# Altium schematic sheet AT Guard Simple Main.SchDoc
size C
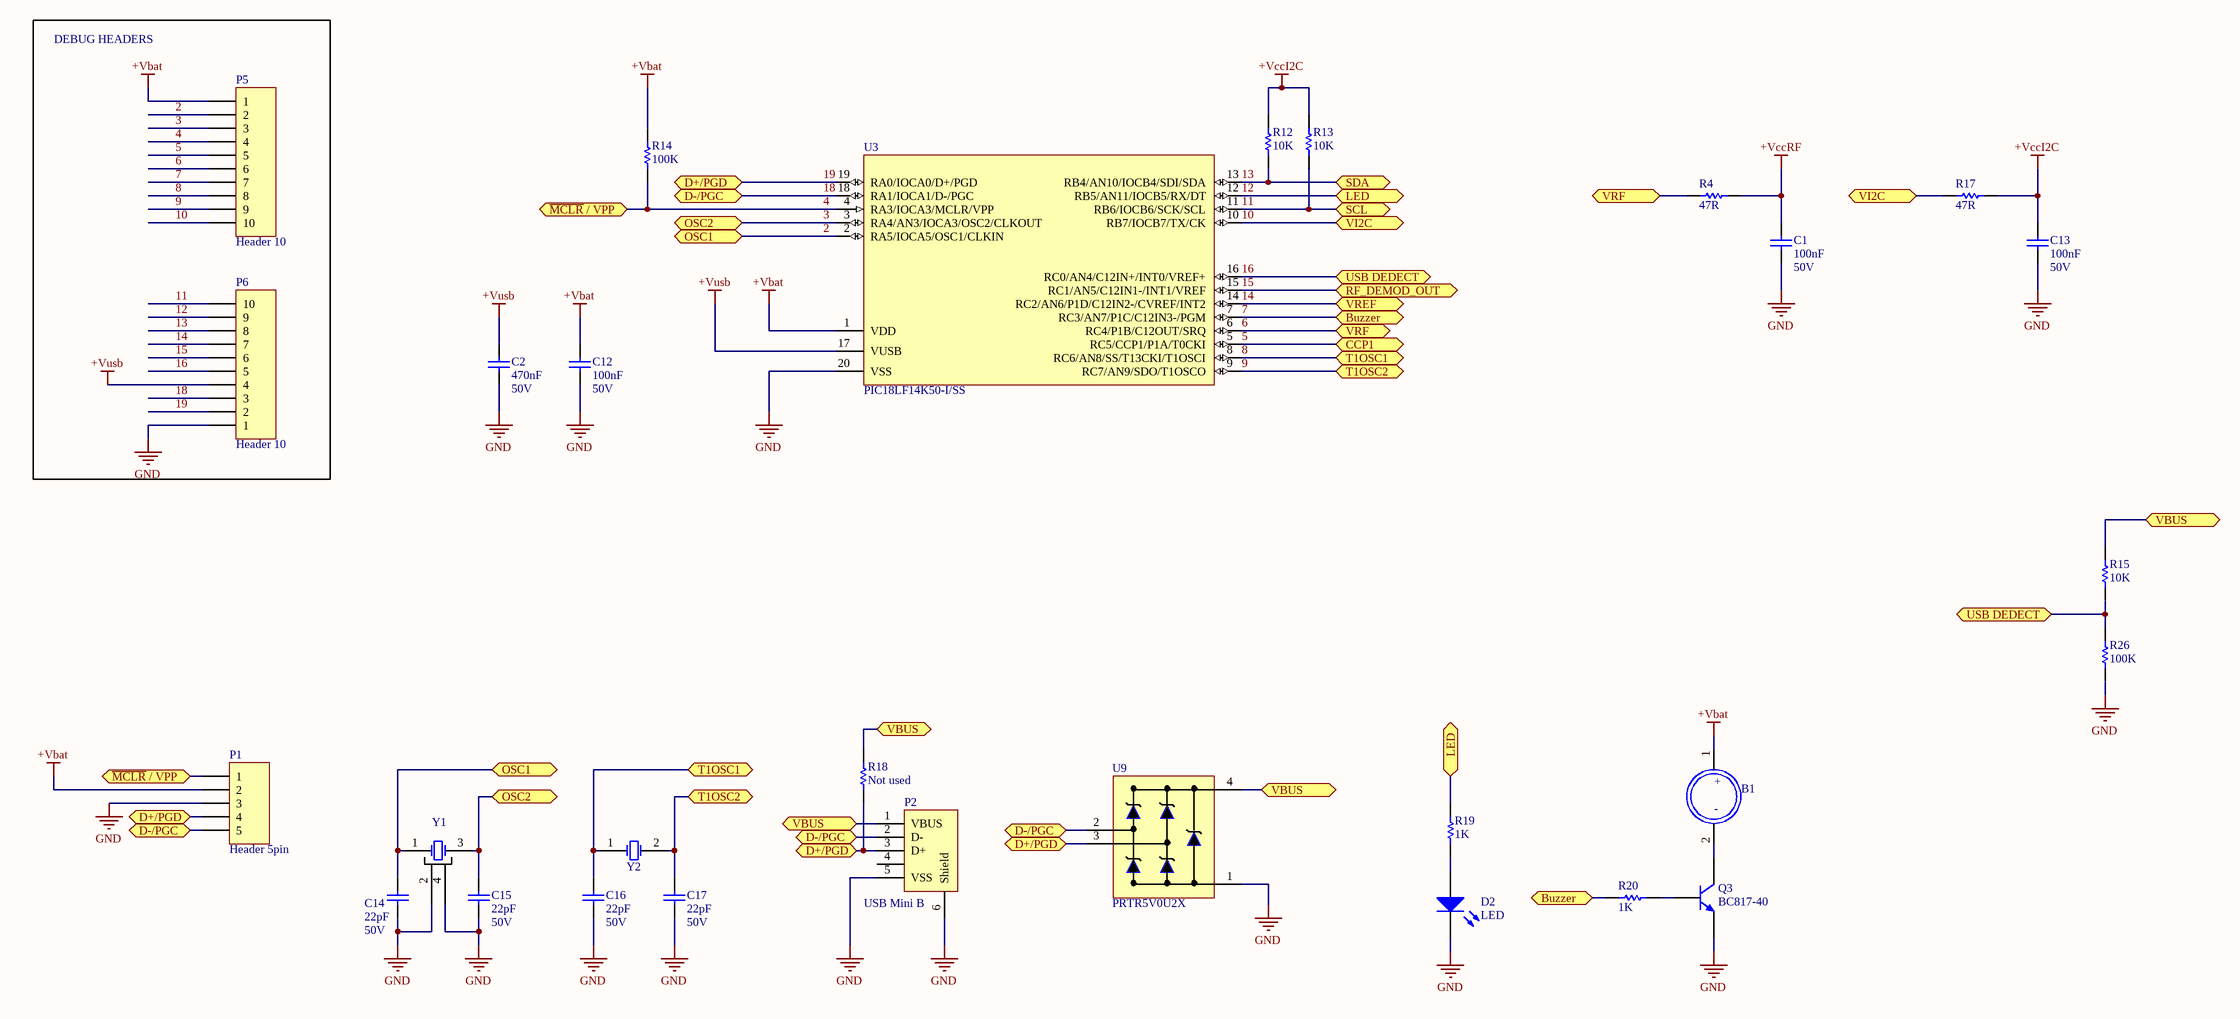
[diagram p0: AT Guard Simple Main.SchDoc]

## Parts
B1  Buzzer 5V r=12mm, h=7.5 mm  [Buzzer 9x5.5 mm]  (value not drawn)
C1  value 100nF  Voltage: 50V  [3-0603_N]  (hidden comment: Cap)
C2  value 470nF  Voltage: 50V  [3-0603_L]  (hidden comment: Cap)
C12  value 100nF  Voltage: 50V  [3-0603_L]  (hidden comment: Cap)
C13  value 100nF  Voltage: 50V  [3-0603_L]  (hidden comment: Cap)
C14  value 22pF  Voltage: 50V  [3-0603_L]  (hidden comment: Cap)
C15  value 22pF  Voltage: 50V  [3-0603_L]  (hidden comment: Cap)
C16  value 22pF  Voltage: 50V  [3-0603_L]  (hidden comment: Cap)
C17  value 22pF  Voltage: 50V  [3-0603_L]  (hidden comment: Cap)
D2  LED  [6-0805 - LED]
P1  Header 5pin  [Header 1.27mm 5P]
P2  USB Mini B  [USB Mini B Female_N 2]
P5  Header 10  [Header 1.27mm 10P]
P6  Header 10  [Header 1.27mm 10P]
Q3  BC817-40  [SOT23_N]
R4  value 47R  [3-0603_N]  (hidden comment: Res1)
R12  value 10K  [3-0603_L]  (hidden comment: Res1)
R13  value 10K  [3-0603_L]  (hidden comment: Res1)
R14  value 100K  [3-0603_L]  (hidden comment: Res1)
R15  value 10K  [3-0603_L]  (hidden comment: Res1)
R17  value 47R  [3-0603_L]  (hidden comment: Res1)
R18  value Not used  [3-0603_L]  (hidden comment: Res1)
R19  value 1K  [3-0603_L]  (hidden comment: Res1)
R20  value 1K  [3-0603_L]  (hidden comment: Res1)
R26  value 100K  [3-0603_L]  (hidden comment: Res1)
U3  PIC18LF14K50-I/SS  [SSOP-20]
U9  PRTR5V0U2X  [SOT-143B]
Y1  Crystal Oscillator  [4x2.5mm & 3.2x2.5 mm SMD CRYSTAL - duplicate]  (value not drawn)
Y2  XTAL_SMT  [32768 SMT 2.1x6.2mm Crystal]  (value not drawn)

## Blocks framed on the sheet
DEBUG HEADERS: P5 P6

## Ports
Buzzer (bidir), CCP1 (bidir), D+/PGD (bidir), D-/PGC (bidir), LED (bidir), OSC1 (bidir), OSC2 (bidir), RF_DEMOD_OUT (bidir), SCL (bidir), SDA (bidir), T1OSC1 (bidir), T1OSC2 (bidir), USB DEDECT (bidir), VBUS, VI2C (bidir), VREF (bidir), VRF (bidir), ~{MCLR} / VPP (bidir)

## Nets
+Vbat: B1.1 C12.2 P1.2 P5.1 R14.2 U3.1(VDD)
+VccI2C: C13.2 R12.2 R13.2 R17.2
+VccRF: C1.2 R4.2
+Vusb: C2.2 P6.4 U3.17(VUSB)
GND: C1.1 C2.1 C12.1 C13.1 C14.1 C15.1 C16.1 C17.1 D2.2(K) P1.3 P2.5(VSS) P2.6(Shield) P6.1 Q3.2(E) R26.1 U3.20(VSS) U9.1 Y1.2(GND) Y1.4(GND)
2: C14.2 P5.2 U3.2(RA5/IOCA5/OSC1/CLKIN) Y1.1(OSC1) ; port OSC1
3: C15.2 P5.3 U3.3(RA4/AN3/IOCA3/OSC2/CLKOUT) Y1.3(OSC2) ; port OSC2
4: P1.1 P5.4 R14.1 U3.4(RA3/IOCA3/MCLR/VPP) ; port ~{MCLR} / VPP
5: P5.5 U3.5(RC5/CCP1/P1A/T0CKI) ; port CCP1
6: P5.6 R4.1 U3.6(RC4/P1B/C12OUT/SRQ) ; port VRF
7: P5.7 R20.2 U3.7(RC3/AN7/P1C/C12IN3-/PGM) ; port Buzzer
8: C16.2 P5.8 U3.8(RC6/AN8/SS/T13CKI/T1OSCI) Y2.1(OSC1) ; port T1OSC1
9: C17.2 P5.9 U3.9(RC7/AN9/SDO/T1OSCO) Y2.2(OSC2) ; port T1OSC2
10: P5.10 R17.1 U3.10(RB7/IOCB7/TX/CK) ; port VI2C
11: P6.10 R13.1 U3.11(RB6/IOCB6/SCK/SCL) ; port SCL
12: P6.9 R19.2 U3.12(RB5/AN11/IOCB5/RX/DT) ; port LED
13: P6.8 R12.1 U3.13(RB4/AN10/IOCB4/SDI/SDA) ; port SDA
14: P6.7 U3.14(RC2/AN6/P1D/C12IN2-/CVREF/INT2) ; port VREF
15: P6.6 U3.15(RC1/AN5/C12IN1-/INT1/VREF) ; port RF_DEMOD_OUT
16: P6.5 R15.1 R26.2 U3.16(RC0/AN4/C12IN+/INT0/VREF+) ; port USB DEDECT
18: P1.5 P2.2(D-) P6.3 U3.18(RA1/IOCA1/D-/PGC) U9.2 ; port D-/PGC
19: P1.4 P2.3(D+) P6.2 R18.1 U3.19(RA0/IOCA0/D+/PGD) U9.3 ; port D+/PGD
VBUS: P2.1(VBUS) R15.2 R18.2 U9.4 ; port VBUS
NetB1_2: B1.2 Q3.3(C)
NetD2_1: D2.1(A) R19.1
NetQ3_1: Q3.1(B) R20.1

Not connected (* = marked no-connect by the designer): P2 4

## Notes on the sheet
- (in symbol Buzzer_) +; -

## Library data of the parts
B1 = Buzzer_
C1 C2 C12-C17 = Cap: Capacitor; Published: 8-Jun-2000; Revision: July-2002: Re-released for DXP Platform.; Publisher: Altium Limited
D2 = LED: Typical INFRARED GaAs LED; Published: 8-Jun-2000; LatestRevisionDate: 08-Jul-2005; LatestRevisionNote: Mech Layer 1 removed.; PackageReference: LED-0; Publisher: Altium Limited
P1 = Header 5 pin: Header 5-Pin; LatestRevisionDate: 17-Jul-2002; LatestRevisionNote: Re-released for DXP Platform.; Publisher: Altium Limited
P5 P6 = Header 10: Header, 10-Pin; LatestRevisionDate: 17-Jul-2002; LatestRevisionNote: Re-released for DXP Platform.; Publisher: Altium Limited
Q3 = BC817-40: NPN General-purpose Transistor; Published: 17-Sep-2003; LatestRevisionDate: 12-Dec-2006; LatestRevisionNote: IPC-7351 Footprint Added.; DatasheetVersion: Jun-1999; PackageVersion: May-1999; PackageReference: SOT23; Publisher: Altium Limited; PackageDescription: 3-Pin SOT-23 Package 0.95 mm Pitch, 2.3 mm Lead Span; ComponentLink1Description: Manufacturer Link; ComponentLink1URL: http://www.semiconductors.philips.com/; ComponentLink2Description: Datasheet; ComponentLink2URL: http://www.semiconductors.philips.com/acrobat/datasheets/BC817_BC817W_BC337_5.pdf
R4 R12-R15 R17-R20 R26 = Res1: Resistor; Published: 8-Jun-2000; LatestRevisionDate: 17-Jul-2002; LatestRevisionNote: Re-released for DXP Platform.; PackageReference: AXIAL-0.3; Publisher: Altium Limited
U3 = PIC18LF14K50-I/SS: High Performance, Enhanced FLASH Microcontroller with 10-Bit A/D and nanoWatt Technology, 8K FLASH, 20-Pin SSOP, Standard Volt Range, Industrial Temperature; Note: OSC1, OSC2, CLKI and CLKO are only available in select Oscillator modes and when these pins are not being used as digital I/O.; Published: 11-Oct-2004; LatestRevisionDate: 04-Mar-2005; LatestRevisionNote: Stylized 3D Model Added.; DatasheetVersion: DS39605B_2002; PackageVersion: 2003; PackageReference: SSOP-20; Publisher: Altium Limited; PackageDescription: SSOP, Plastic; 20 Leads; Body Width 5.3 mm; Pitch 0.65 mm; Code_JEDEC: MO-150; ComponentLink1Description: Manufacturer Link; ComponentLink1URL: http://www.microchip.com; ComponentLink2Description: Datasheet; ComponentLink2URL: http://ww1.microchip.com/downloads/en/DeviceDoc/39605b.pdf; ComponentLink3Description: Packaging Specification; ComponentLink3URL: http://ww1.microchip.com/downloads/en/PackagingSpec/00049AD.pdf
U9 = PRTR5V0U2X: Ultra low capacitance double rail-to-rail ESD protection diode; Published: 13-Oct-2000; LatestRevisionDate: 06-Jun-2005; LatestRevisionNote: Stylized 3D Model Added.; DatasheetVersion: 10-Aug-1999; PackageVersion: 1999; PackageReference: DIP8; Publisher: Altium Limited; PackageDescription: DIP; 8 Leads; Row Spacing 7.62 mm; Pitch 2.54 mm; ComponentLink1Description: Manufacturer Link; ComponentLink1URL: http://www.maxim-ic.com/; ComponentLink2Description: Datasheet; ComponentLink2URL: http://pdfserv.maxim-ic.com/en/ds/DS1307.pdf; ComponentLink3Description: Discontinuation Notice; ComponentLink3URL: http://www.maxim-ic.com/qa/pdfs/non-obsolescence-letter.pdf
Y1 = Crystal Oscillator: Value: 12MHz; Published: 8-Jun-2000; LatestRevisionDate: 17-Jul-2002; LatestRevisionNote: Re-released for DXP Platform.; PackageReference: R38; Publisher: Altium Limited
Y2 = XTAL_SMT: Crystal Oscillator; Published: 8-Jun-2000; LatestRevisionDate: 17-Jul-2002; LatestRevisionNote: Re-released for DXP Platform.; PackageReference: R38; Publisher: Altium Limited
P2 = USB Mini B: LatestRevisionDate: 17-Jul-2002; LatestRevisionNote: Re-released for DXP Platform.; Publisher: Altium Limited